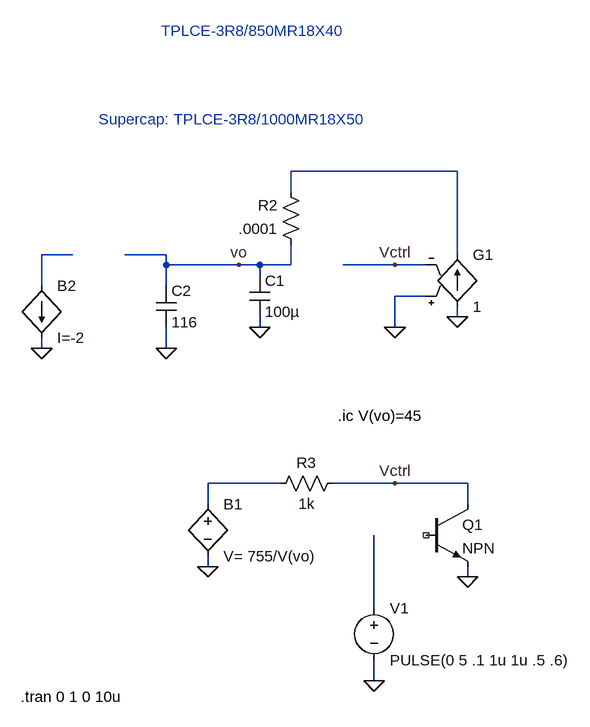
[diagram p0: schematic Supercap_2.asc]
Supercap_2.asc, the LTspice schematic file:
Version 4.1
SHEET 1 880 680
WIRE 608 -144 352 -144
WIRE 352 -112 352 -144
WIRE 16 -16 -32 -16
WIRE 160 -16 96 -16
WIRE 608 -16 608 -144
WIRE 160 0 160 -16
WIRE 272 0 160 0
WIRE 304 0 272 0
WIRE 352 0 352 -32
WIRE 352 0 304 0
WIRE 512 0 432 0
WIRE 560 0 512 0
WIRE 304 16 304 0
WIRE -32 32 -32 -16
WIRE 160 32 160 0
WIRE 560 48 512 48
WIRE 608 80 608 64
WIRE 304 96 304 80
WIRE 512 96 512 48
WIRE -32 128 -32 112
WIRE 160 128 160 96
WIRE 336 336 224 336
WIRE 512 336 416 336
WIRE 624 336 512 336
WIRE 224 368 224 336
WIRE 624 368 624 336
WIRE 224 464 224 448
WIRE 624 480 624 464
WIRE 480 528 480 416
WIRE 480 640 480 608
FLAG 272 0 vo
FLAG 160 128 0
FLAG -32 128 0
FLAG 304 96 0
FLAG 608 80 0
FLAG 512 96 0
FLAG 512 0 Vctrl
FLAG 224 464 0
FLAG 512 336 Vctrl
FLAG 624 480 0
FLAG 480 640 0
SYMBOL cap 144 32 R0
SYMATTR InstName C2
SYMATTR Value 116
SYMATTR SpiceLine V=45.6 Rser=.6
SYMBOL bi -32 32 R0
SYMATTR InstName B2
SYMATTR Value I=-2
SYMBOL res 368 -16 R180
WINDOW 0 36 76 Left 2
WINDOW 3 36 40 Left 2
SYMATTR InstName R2
SYMATTR Value .0001
SYMBOL cap 288 16 R0
SYMATTR InstName C1
SYMATTR Value 100µ
SYMBOL g2 608 -32 R0
SYMATTR InstName G1
SYMATTR Value 1
SYMBOL bv 224 352 R0
SYMATTR InstName B1
SYMATTR Value V= 755/V(vo)
SYMBOL res 432 320 R90
WINDOW 0 0 56 VBottom 2
WINDOW 3 32 56 VTop 2
SYMATTR InstName R3
SYMATTR Value 1k
SYMBOL npn 560 368 R0
SYMATTR InstName Q1
SYMBOL voltage 480 512 R0
WINDOW 123 0 0 Left 0
WINDOW 39 0 0 Left 0
SYMATTR InstName V1
SYMATTR Value PULSE(0 5 .1 1u 1u .5 .6)
TEXT 424 232 Left 2 !.ic V(vo)=45
TEXT 56 -224 Left 2 ;Supercap: TPLCE-3R8/1000MR18X50
TEXT -64 664 Left 2 !.tran 0 1 0 10u
TEXT 152 -360 Left 2 ;TPLCE-3R8/850MR18X40

The netlist it stands for:
* Supercap_2.asc
C2 vo 0 116 V=45.6 Rser=.6
B2 N002 0 I=-2
R2 vo N001 .0001
C1 vo 0 100µ
G1 0 N001 0 Vctrl 1
B1 N003 0 V= 755/V(vo)
R3 Vctrl N003 1k
Q1 Vctrl NC_01 0 0 NPN
V1 N004 0 PULSE(0 5 .1 1u 1u .5 .6)
.model NPN NPN
.model PNP PNP
.lib standard.bjt
.ic V(vo)=45
* Supercap: TPLCE-3R8/1000MR18X50
.tran 0 1 0 10u
* TPLCE-3R8/850MR18X40
.backanno
.end